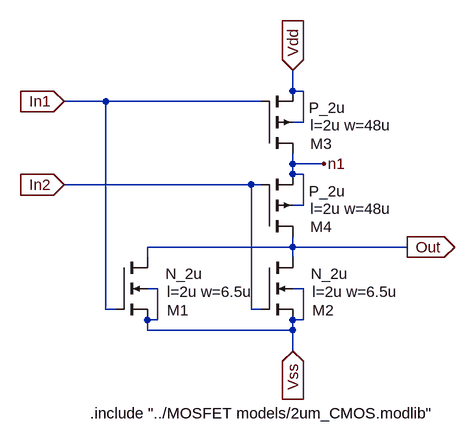
[diagram p0: schematic NOR2.asc]
NOR2.asc, the LTspice schematic file:
Version 4
SHEET 1 880 680
WIRE 192 -64 192 -96
WIRE 208 -64 192 -64
WIRE -96 -48 -160 -48
WIRE 144 -48 -96 -48
WIRE 208 -16 208 -64
WIRE 208 -16 192 -16
WIRE 192 48 192 32
WIRE 240 48 192 48
WIRE 192 64 192 48
WIRE 208 64 192 64
WIRE 128 80 -160 80
WIRE 144 80 128 80
WIRE 208 112 208 64
WIRE 208 112 192 112
WIRE 192 176 192 160
WIRE 192 176 -32 176
WIRE 368 176 192 176
WIRE -32 192 -32 176
WIRE 192 192 192 176
WIRE -16 240 -32 240
WIRE 208 240 192 240
WIRE -96 272 -96 -48
WIRE -80 272 -96 272
WIRE 128 272 128 80
WIRE 144 272 128 272
WIRE -16 288 -16 240
WIRE -16 288 -32 288
WIRE 208 288 208 240
WIRE 208 288 192 288
WIRE -32 304 -32 288
WIRE 192 304 192 288
WIRE 192 304 -32 304
WIRE 192 336 192 304
FLAG 192 -96 Vdd
IOPIN 192 -96 In
FLAG 192 336 Vss
IOPIN 192 336 In
FLAG -160 -48 In1
IOPIN -160 -48 In
FLAG -160 80 In2
IOPIN -160 80 In
FLAG 368 176 Out
IOPIN 368 176 Out
FLAG 240 48 n1
SYMBOL nmos4 144 192 R0
WINDOW 0 78 81 Left 2
WINDOW 3 76 25 Left 2
WINDOW 123 78 53 Left 2
SYMATTR InstName M2
SYMATTR Value N_2u
SYMATTR Value2 l=2u w=6.5u
SYMBOL pmos4 144 160 M180
WINDOW 0 75 15 Left 2
WINDOW 3 73 70 Left 2
WINDOW 123 75 43 Left 2
SYMATTR InstName M4
SYMATTR Value P_2u
SYMATTR Value2 l=2u w=48u
SYMBOL pmos4 144 32 M180
WINDOW 0 75 15 Left 2
WINDOW 3 73 70 Left 2
WINDOW 123 75 43 Left 2
SYMATTR InstName M3
SYMATTR Value P_2u
SYMATTR Value2 l=2u w=48u
SYMBOL nmos4 -80 192 R0
WINDOW 0 78 81 Left 2
WINDOW 3 76 25 Left 2
WINDOW 123 78 53 Left 2
SYMATTR InstName M1
SYMATTR Value N_2u
SYMATTR Value2 l=2u w=6.5u
TEXT -120 432 Left 2 !.include "../MOSFET models/2um_CMOS.modlib"

The netlist it stands for:
* NOR2.asc
M2 Out In2 Vss Vss N_2u l=2u w=6.5u
M4 Out In2 n1 n1 P_2u l=2u w=48u
M3 n1 In1 Vdd Vdd P_2u l=2u w=48u
M1 Out In1 Vss Vss N_2u l=2u w=6.5u
.model NMOS NMOS
.model PMOS PMOS
.lib standard.mos
.include "../MOSFET models/2um_CMOS.modlib"
.backanno
.end